# EAGLE design usbirtransceiver (EAGLE 6.2)
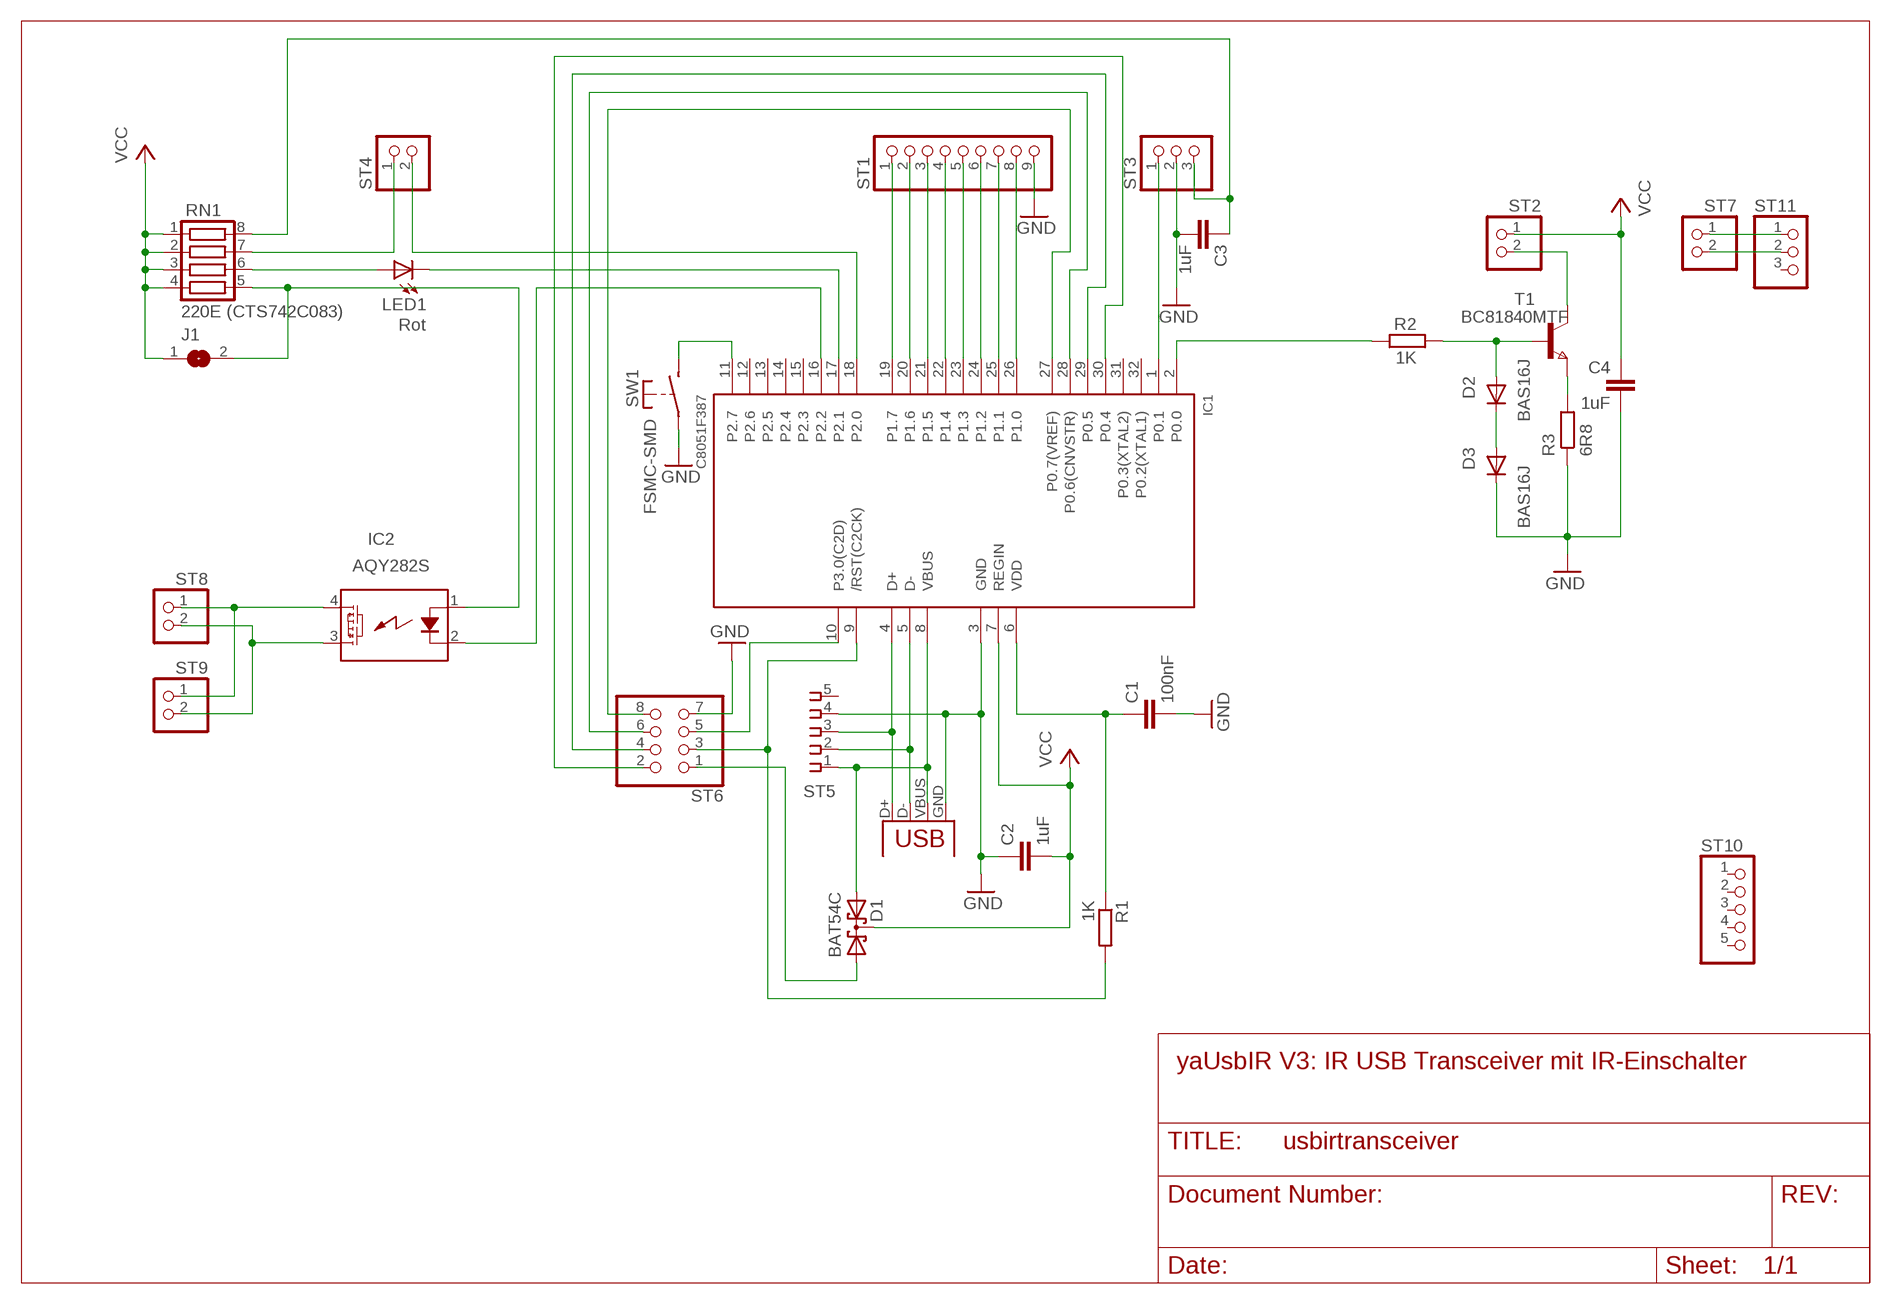
[diagram p0: schematic, sheet 1]

## Parts
C1  100nF  C-EUC0805  [C0805]
C2  1uF  C-EUC0805  [C0805]
C3  1uF  C-EUC0805  [C0805]
C4  1uF  C-EUC0805  [C0805]
D1  BAT54C  [SOT23]
D2  BAS16J  DIODE-SOD323-R  [SOD323-R]
D3  BAS16J  DIODE-SOD323-R  [SOD323-R]
IC1  C8051F387  C8051F342  [TQFP32-08]
IC2  AQY282S  AQY22SOP  [SOP04]
J1  SJ  [SJ]
LED1  Rot  LEDCHIP-LED0805  [CHIP-LED0805]
R1  1K  R-EU_R0805  [R0805]
R2  1K  R-EU_R0805  [R0805]
R3  6R8  R-EU_M1206  [M1206]
RN1  220E (CTS742C083)  CTS742C083  [CTS742C083]
ST1  PINHD-1X9  [1X09]
ST2  PINHD-1X2  [1X02]
ST3  PINHD-1X3  [1X03]
ST4  PINHD-1X2  [1X02]
ST5  CON5PINSMD2.54  [SMDTOP5]
ST6  PINHD-2X4  [2X04]
ST7  PINHD-1X2  [1X02]
ST8  PINHD-1X2  [1X02]
ST9  PINHD-1X2  [1X02]
ST10  PINHD-1X5_2.54-SMD-90°  [1X05SMD/90]
ST11  PINHD-1X3  [1X03]
ST12  USB-MB-S  [USB-MB-S]
SW1  FSMC-SMD  [FSMC-SMD]
T1  BC81840MTF  NPNSOT23  [SOT-23]

## Nets
GND [POWER]: C1.2 C2.1 C3.2 C4.2 D3.C IC1.3(GND) R3.1 ST1.9 ST3.2 ST5.4 ST6.7 ST12.GND SW1.P$1(P)
N$1: LED1.A RN1.6
N$2: RN1.7 ST4.1
N$3: IC2.1(A) J1.2 RN1.5
N$4: IC1.19(P1.7) ST1.1
N$5: IC1.20(P1.6) ST1.2
N$6: IC1.21(P1.5) ST1.3
N$7: IC1.22(P1.4) ST1.4
N$8: IC1.23(P1.3) ST1.5
N$9 [POWER]: ST2.2 T1.1(C)
N$10: IC1.24(P1.2) ST1.6
N$11: IC1.25(P1.1) ST1.7
N$12: IC1.26(P1.0) ST1.8
N$13: IC1.17(P2.1) LED1.C
N$14: IC2.4(DS1) ST8.1 ST9.1
N$15: C1.1 IC1.6(VDD) R1.1
N$16: ST7.1 ST11.1
N$17: IC1.27(P0.7(VREF)) ST6.8
N$18: D2.C D3.A
N$19: IC1.18(P2.0) ST4.2
N$20: IC1.16(P2.2) IC2.2(K)
N$22: D2.A R2.1 T1.3(B)
N$23: IC1.5(D-) ST5.2 ST12.D-
N$24: IC1.28(P0.6(CNVSTR)) ST6.6
N$25 [POWER]: R3.2 T1.2(E)
N$26: IC1.4(D+) ST5.3 ST12.D+
N$27: IC2.3(DS2) ST8.2 ST9.2
N$28: IC1.30(P0.4) ST6.2
N$30: IC1.10(P3.0(C2D)) ST6.5
N$31: IC1.1(P0.1) ST3.1
N$32: IC1.29(P0.5) ST6.4
N$33: IC1.9(/RST(C2CK)) R1.2 ST6.3
N$34: ST7.2 ST11.2
N$36: IC1.11(P2.7) SW1.P$2(S)
N$37: IC1.2(P0.0) R2.2
N$38 [POWER]: C3.1 RN1.8 ST3.3
VCC [POWER]: C2.2 C4.1 D1.3(CC) IC1.7(REGIN) J1.1 RN1.1 RN1.2 RN1.3 RN1.4 ST2.1
VCC1 [POWER3]: D1.2(A2) IC1.8(VBUS) ST5.1 ST12.VBUS
VCC2: D1.1(A1) ST6.1
Unconnected: IC1.12(P2.6) IC1.13(P2.5) IC1.14(P2.4) IC1.15(P2.3) IC1.31(P0.3(XTAL2)) IC1.32(P0.2(XTAL1)) ST5.5 ST10.1 ST10.2 ST10.3 ST10.4 ST10.5 ST11.3

## Notes on the sheet
- yaUsbIR V3: IR USB Transceiver mit IR-Einschalter

## Library data of the parts
C1 C2 C4 = resistor:C-EU: CAPACITOR, European symbol
C3 = resistor:C-EU: CAPACITOR, European symbol; SPAN: 25V; TOL: 10%
D1 = diode:BAT54C: Schottky Diodes Source: Fairchild .. BAT54.pdf
D2 D3 = diode:DIODE-: DIODE
IC1 = silabs-2:C8051F342: Full Speed USB Flash MCU
IC2 = relay:AQY*: PhotoMOS Relay NAiS Source: http://www.panasonic-electric-works.com/catalogues/downloads/photomos/ds_x615_en_aqz10_20.pdf; OC_FARNELL: unknown; OC_NEWARK: unknown
J1 = jumper:SJ: SMD solder JUMPER
LED1 = led:LED: LED OSRAM: - CHIPLED LG R971, LG N971, LY N971, LG Q971, LY Q971, LO R971, LY R971 LH N974, LH R974 LS Q976, LO Q976, LY Q976 LO Q996 - Hyper CHIPLED LW Q18S LB Q993, LB Q99A, LB R99A - SideLED LS A670, LO A670, LY A670, LG A670, LP A670 LB A673, LV A673, LT A673, LW A673 LH A674 LY A675 LS A676, LA A676, LO A676, LY A676, LW A676 LS A679, LY A679, LG A679 - Hyper Micro SIDELED® LS Y876, LA Y876, LO Y876, LY Y876 LT Y87S - SmartLED LW L88C, LW L88S LB L89C, LB L89S, LG L890 LS L89K, LO L89K, LY L89K LS L896, LA L896, LO L896, LY L896 - TOPLED LS T670, LO T670, LY T670, LG T670, LP T670 LSG T670, LSP T670, LSY T670, LOP T670, LYG T670 LG T671, LOG T671, LSG T671 LB T673, LV T673, LT T673, LW T673 LH T674 LS T676, LA T676, LO T676, LY T676, LB T676, LH T676, LSB T676, LW T676 LB T67C, LV T67C, LT T67C, LS T67K, LO T67K, LY T67K, LW E67C LS E67B, LA E67B, LO E67B, LY E67B, LB E67C, LV E67C, LT E67C LW T67C LS T679, LY T679, LG T679 LS T770, LO T770, LY T770, LG T770, LP T770 LB T773, LV T773, LT T773, LW T773 LH T774 LS E675, LA E675, LY E675, LS T675 LS T776, LA T776, LO T776, LY T776, LB T776 LHGB T686 LT T68C, LB T68C - Hyper Mini TOPLED® LB M676 - Mini TOPLED Santana® LG M470 LS M47K, LO M47K, LY M47K Source: http://www.osram.convergy.de LUXEON: - LUMILED® LXK2-PW12-R00, LXK2-PW12-S00, LXK2-PW14-U00, LXK2-PW14-V00 LXK2-PM12-R00, LXK2-PM12-S00, LXK2-PM14-U00 LXK2-PE12-Q00, LXK2-PE12-R00, LXK2-PE12-S00, LXK2-PE14-T00, LXK2-PE14-U00 LXK2-PB12-K00, LXK2-PB12-L00, LXK2-PB12-M00, LXK2-PB14-N00, LXK2-PB14-P00, LXK2-PB14-Q00 LXK2-PR12-L00, LXK2-PR12-M00, LXK2-PR14-Q00, LXK2-PR14-R00 LXK2-PD12-Q00, LXK2-PD12-R00, LXK2-PD12-S00 LXK2-PH12-R00, LXK2-PH12-S00 LXK2-PL12-P00, LXK2-PL12-Q00, LXK2-PL12-R00 Source: www.luxeon.com KINGBRIGHT: KA-3528ASYC Source: www.kingbright.com
R1-R3 = resistor:R-EU_: RESISTOR, European symbol
RN1 = resistor-net:CTS742C083: Chip Resistor Array 4 Single Resistor Source: http://www.ctscorp.com/components/Datasheets/CTSChipArrayDs.pdf; OC_FARNELL: unknown; OC_NEWARK: unknown
ST1 = pinhead:PINHD-1X9: PIN HEADER
ST2 ST4 ST7-ST9 = pinhead:PINHD-1X2: PIN HEADER
ST3 ST11 = pinhead:PINHD-1X3: PIN HEADER
ST5 = smdconnector2.54:CON5PINSMD2.54: connector
ST6 = pinhead:PINHD-2X4: PIN HEADER
ST10 = pinhead-1:PINHD-1X5: PIN HEADER
ST12 = con-usb:USB: USB Connectors
SW1 = switch-misc:FSMC-SMD: TYCO SWITCH
T1 = zetex:NPNSOT23: NPN TRANSISTOR; MPN: DSS20201L-7; OC_FARNELL: 1710688; OC_NEWARK: 25R4555

## Net classes
1 POWER: width 0.559 mm
2 POWER2: width 1.321 mm
3 POWER3: width 0.559 mm

## Board
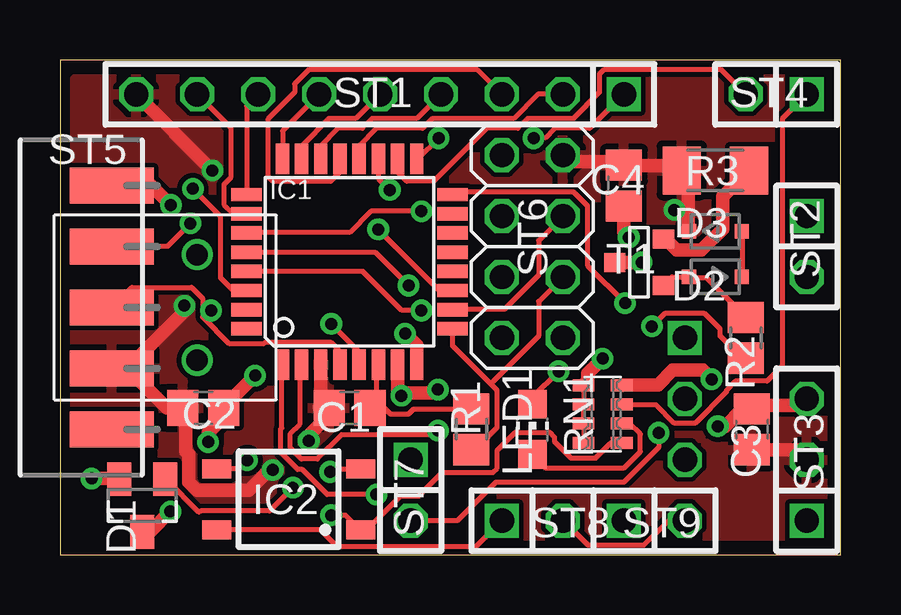
[diagram p1: board, top side]
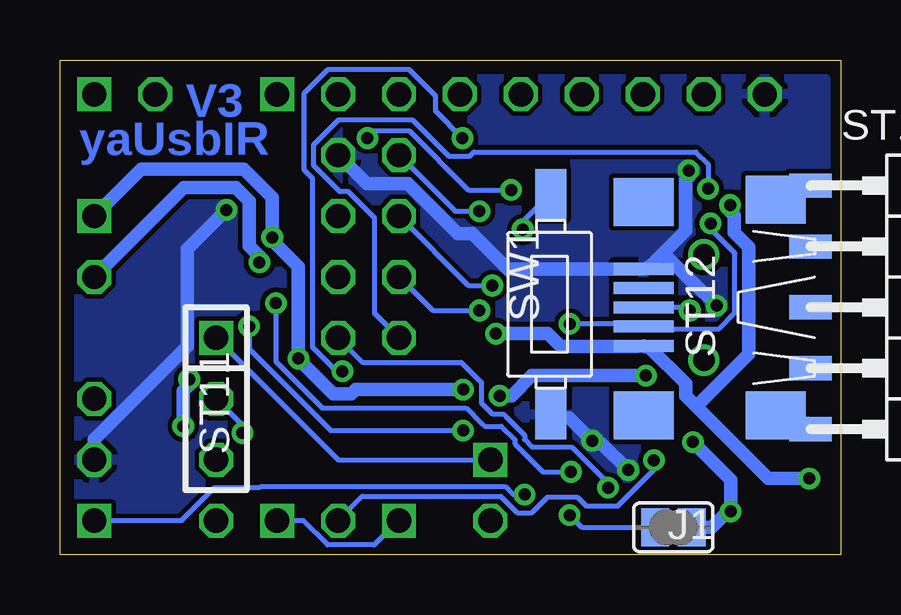
[diagram p2: board, bottom side, seen from below]

Size 32.54 x 20.64 mm. Coordinates in mm from the lower left corner, seen from the top.
Outline: 0,0 32.54,0 32.54,20.64 0,20.64 0,0
Copper layers (1*16): Top 0.035mm / dielectric 1.5mm / Bottom 0.035mm
Design rules: minimum track width 0.2mm, minimum drill 0.5mm, track to track 0.2mm, track to pad 0.2mm, pad to pad 0.15mm, via to via 0.2mm, smd to smd 0mil, copper to edge 0.2mm, drill to drill 0.2mm, minimum pad ring 0.2mm, minimum via ring 0.2mm, stop-mask expansion 0.1mm, vias tented up to drill 0mil, thermal gap 10mil

### Footprints (pad centres in the part's own frame; a part is rotated, then mirrored left to right if it is on the bottom)
C0805 = smd 1.3 x 1.5: 1 -0.85,0; 2 0.85,0
SOT23 = smd 1 x 1.4: 1 -0.95,-1.1; 2 0.95,-1.1; 3 0,1.1
SOD323-R = smd 0.6 x 0.6: A 1.1,0; C -1.1,0
TQFP32-08 = smd 1.27 x 0.559: 1 -4.293,2.8; 2 -4.293,2; 3 -4.293,1.2; 4 -4.293,0.4; 5 -4.293,-0.4; 6 -4.293,-1.2; 7 -4.293,-2; 8 -4.293,-2.8; 17 4.293,-2.8; 18 4.293,-2; 19 4.293,-1.2; 20 4.293,-0.4; 21 4.293,0.4; 22 4.293,1.2; 23 4.293,2; 24 4.293,2.8 | smd 0.559 x 1.27: 9 -2.8,-4.293; 10 -2,-4.293; 11 -1.2,-4.293; 12 -0.4,-4.293; 13 0.4,-4.293; 14 1.2,-4.293; 15 2,-4.293; 16 2.8,-4.293; 25 2.8,4.293; 26 2,4.293; 27 1.2,4.293; 28 0.4,4.293; 29 -0.4,4.293; 30 -1.2,4.293; 31 -2,4.293; 32 -2.8,4.293
SOP04 = smd 0.8 x 1.2: 1 -1.27,-3; 2 1.27,-3; 3 1.27,3; 4 -1.27,3
SJ = smd 1.168 x 1.6: 1 -0.762,0; 2 0.762,0
CHIP-LED0805 = smd 1.2 x 1.2: A 0,-1.05; C 0,1.05
R0805 = smd 1.3 x 1.5: 1 -0.85,0; 2 0.85,0
M1206 = smd 1.6 x 2: 1 -1.4,0; 2 1.4,0
CTS742C083 = smd 0.5 x 0.9: 1 -1.2,-0.8; 2 -0.4,-0.8; 3 0.4,-0.8; 4 1.2,-0.8; 5 1.2,0.8; 6 0.4,0.8; 7 -0.4,0.8; 8 -1.2,0.8
1X09 = drill 1.016 square: 1 -10.16,0 | drill 1.016 octagon: 2 -7.62,0; 3 -5.08,0; 4 -2.54,0; 5 0,0; 6 2.54,0; 7 5.08,0; 8 7.62,0; 9 10.16,0
1X02 = drill 1.016 square: 1 -1.27,0 | drill 1.016 octagon: 2 1.27,0
1X03 = drill 1.016 square: 1 -2.54,0 | drill 1.016 octagon: 2 0,0; 3 2.54,0
SMDTOP5 = smd 3.5 x 1.5: 1 -1.27,5.715; 2 -1.27,3.175; 3 -1.27,0.635; 4 -1.27,-1.905; 5 -1.27,-4.445
2X04 = drill 1.016 octagon: 1 -3.81,-1.27; 2 -3.81,1.27; 3 -1.27,-1.27; 4 -1.27,1.27; 5 1.27,-1.27; 6 1.27,1.27; 7 3.81,-1.27; 8 3.81,1.27
1X05SMD/90 = smd 1.016 x 1.778: 1 -1.27,-5.08; 2 1.27,-5.08; 3 3.81,-5.08; 4 6.35,-5.08; 5 8.89,-5.08
USB-MB-S = smd 2.5 x 0.5: D+ 2.5,0; D- 2.5,0.8; GND 2.5,-1.6; ID 2.5,-0.8; VBUS 2.5,1.6 | smd 2.5 x 2: P$1 -3,-4.5; P$2 -3,4.5; P$3 2.5,-4.4; P$4 2.5,4.5 | drill 0.9: P$5 0,2.2; P$6 0,-2.2
FSMC-SMD = smd 1.3 x 2.1: P$1 -0.096,4.584; P$2 -0.096,-4.6
SOT-23 = smd 0.787 x 0.889: 1 0.025,-1.016; 2 -0.94,1.016; 3 0.991,1.016

### Placement (x,y rotation side)
C1  12.07,6.13 180 top
C2  5.97,6.13 0 top
C3  28.83,5.24 270 top
C4  23.5,15.4 90 top
D1  3.43,2.06 180 top
D2  27.3,11.59 180 top
D3  27.3,13.49 0 top
IC1  12.07,12.22 90 top
IC2  9.52,2.32 90 top
J1  6.99,1.15 180 bottom
LED1  19.68,5.24 0 top
R1  17.14,5.24 270 top
R2  28.57,9.05 270 top
R3  27.3,16.04 0 top
RN1  22.61,5.88 270 top
ST1  13.34,19.21 180 top
ST2  31.11,12.86 270 top
ST3  31.11,3.97 90 top
ST4  29.85,19.21 180 top
ST5  3.42,9.69 0 top
ST6  19.68,12.86 90 top
ST7  14.61,2.7 270 top
ST8  19.68,1.43 0 top
ST9  24.77,1.43 0 top
ST10  -3.81,14.13 270 bottom
ST11  26.04,6.51 270 bottom
ST12  5.72,10.32 180 bottom
SW1  12.19,10.45 180 bottom
T1  24.13,12.22 270 top

### Tracks (layer width: path | path; a pad name or v marks a point on that pad's centre or on a via)
GND  (via drill 0.5)
  Top 0.559: ST3.2 30.71,4.38 28.83,4.38 C3.2 | 26.19,14.38 26.19,15.76 R3.1 25.73,16.24 23.5,16.24 C4.2 23.24,16.39 21.23,16.39 ST6.7 | 26.19,14.38 26.19,13.49 D3.C | v6.35,16.04 ST1.9 | 26.19,14.38 v25.6,14.38 | v5.18,10.4 5.18,10.14 3,7.96 ST5.4 2.79,7.78 4.45,6.13 C2.1 5.23,5.88 5.23,4.33 5.36,4.2 5.36,3.06 5.72,2.7 7.87,2.7 8.71,3.54 v8.86,3.54 | IC1.3 10.87,6.46 11.2,6.13 C1.2 | 10.8,6.15 C1.2 | v10.36,4.76 10.36,4.99 11.23,5.85 C1.2
  Bottom 0.559: ST6.7 19.76,15.48 18.06,15.48 15.98,13.39 15.37,13.39 13.89,11.92 8.23,11.92 ST12.GND 7.95,12.05 7.4,12.59 | v6.35,16.04 6.35,15.78 6.48,15.65 6.48,13.52 7.4,12.59 | ST3.2 31.11,4.81 27.23,8.69 27.23,12.76 v25.6,14.38 | v5.18,10.4 6.17,11.39 6.2,11.39 7.4,12.59 | 11.94,5.85 SW1.P$1 11.68,5.72 11.33,5.72 v10.36,4.76 10.11,4.63 9.96,4.63 v8.86,3.54
  pour Bottom: 0.64,19.85 31.75,19.85 31.75,0.8 0.64,0.8
  pour Top: 0.64,19.85 31.75,19.85 31.75,0.8 0.64,0.8
N$1
  Top 0.2: RN1.6 23.42,5.47 23.75,5.47 24.18,5.04 24.18,4.3 23.52,3.64 20.22,3.64 19.68,4.17 LED1.A
N$2
  Top 0.2: ST4.1 30.1,18.19 30.1,7.88 29.46,7.25 28.14,7.25 27.76,6.87 27.76,6.79 26.47,5.49 25.6,5.49 24.84,6.26 23.42,6.26 RN1.7
N$3  (via drill 0.5)
  Top 0.2: RN1.5 23.39,4.66 22.94,4.66 22.33,4.05 21.29,4.05 20.6,4.73 20.6,4.91 20.4,5.11 18.97,5.11 18.21,4.35 18.21,3.61 18.03,3.44 15.93,3.44 14.93,2.45 14.17,2.45 12.78,1.05 IC2.1 12.45,1.1 11.89,1.66 v11.3,1.66
  Bottom 0.2: v11.3,1.66 10.8,1.15 J1.2
N$4  (via drill 0.5)
  Top 0.2: v13.74,15.22 13.28,15.68 13.28,16.52 IC1.19 | v19.74,17.38 20.22,17.38 20.62,17.79 22.07,17.79 ST1.1
  Bottom 0.2: v13.74,15.22 15.52,15.22 17.98,17.69 19.43,17.69 v19.74,17.38
N$5
  Top 0.2: ST1.2 19.91,19.21 18.9,18.19 15.52,18.19 15.11,17.79 13.18,17.79 12.47,17.08 IC1.20
N$6
  Top 0.2: ST1.3 17.4,20.23 10.36,20.23 9.78,19.64 9.78,19.29 8.66,18.17 8.66,15.78 8.86,15.58 11.28,15.58 11.66,15.96 IC1.21
N$7
  Top 0.2: ST1.4 14.86,18.19 13,18.19 12.6,17.79 11.58,17.79 10.87,17.08 IC1.22
N$8
  Top 0.2: ST1.5 12.32,18.19 11.2,18.19 10.08,17.08 10.08,16.52 IC1.23
N$9  (via drill 0.5)
  Top 0.559: v24.23,12.2 T1.1
  Bottom 0.559: v24.23,12.2 24.23,12.45 24.66,12.88 24.66,14.76 25.22,15.32 27.38,15.32 ST2.2
N$10
  Top 0.2: ST1.6 9.27,17.69 IC1.24
N$11
  Top 0.2: IC1.25 7.77,18.73 ST1.7
N$12
  Top 0.2: ST1.8 7.11,17.81 7.11,15.73 6.83,15.45 6.83,14.61 7.21,14.23 IC1.26
N$13  (via drill 0.5)
  Top 0.2: LED1.C 19.68,6.56 v20.78,7.65 | v15.77,17.38 14.91,16.52 IC1.17
  Bottom 0.2: v20.78,7.65 21.01,7.65 22.02,8.67 22.02,15.71 22.38,16.06 22.38,19.24 21.39,20.23 17.98,20.23 16.89,19.13 16.89,18.5 v15.77,17.38
N$14
  Top 0.2: IC2.4 10.85,1.05 11.56,0.34 17.32,0.34 ST8.1
  Bottom 0.2: ST9.1 22.4,1.43 21.39,0.41 19.46,0.41 18.49,1.38 ST8.1
N$15
  Top 0.2: IC1.6 13.21,7.86 13.21,6.41 12.93,6.13 C1.1 13.28,6.36 13.77,5.88 14.53,5.88 14.73,6.08 17.14,6.08 R1.1
N$16
  Bottom 0.2: ST11.1 20.95,3.97 ST7.1
N$17  (via drill 0.5)
  Top 0.2: v15.06,14.33 12.95,14.33 12.07,13.44 7.77,13.44 IC1.27
  Bottom 0.2: v15.06,14.33 16.08,14.33 ST6.8
N$18
  Top 0.2: D2.C 28.42,11.59 28.42,13.49 D3.A
N$19
  Top 0.2: ST4.2 27.56,20.23 22.66,20.23 22.48,20.05 22.48,19.29 21.39,18.19 19.48,18.19 19.07,17.79 17.78,17.79 15.57,15.58 14.45,15.58 14.07,15.96 IC1.18
N$20  (via drill 0.5)
  Top 0.2: v23.55,10.5 21.97,12.07 21.97,14.56 21.39,15.15 16.46,15.15 16.36,15.04 IC1.16 | IC2.2 11.38,3.59 v11.25,3.46
  Bottom 0.2: v23.55,10.5 23.55,8.06 21.61,6.13 15.62,6.13 14.96,5.47 14.88,5.42 14.83,5.37 14.15,5.37 13.59,4.81 13.59,4.63 12.42,3.46 v11.25,3.46
N$22
  Top 0.2: T1.3 25.5,11.59 D2.A 26.29,11.54 26.95,11.54 28.57,9.91 R2.1
N$23  (via drill 0.5)
  Top 0.2: v11.3,9.63 12.45,8.49 12.45,7.93 IC1.5 | ST5.2 4.47,12.86 v5.44,13.83
  Bottom 0.2: v11.3,9.63 8.33,9.63 8.23,9.53 ST12.D- 8.18,9.43 5.08,9.43 4.42,10.09 4.42,12.58 5.44,13.6 v5.44,13.83
N$24  (via drill 0.5)
  Top 0.2: v14.53,11.23 13.16,12.61 7.77,12.61 IC1.28
  Bottom 0.2: v14.53,11.23 15.52,11.23 ST6.6
N$25
  Top 0.559: T1.2 25.25,13.17 25.7,12.71 26.72,12.71 27.61,13.6 27.61,14.94 R3.2
N$26  (via drill 0.5)
  Top 0.2: 5.94,10.19 5.94,10.7 5.49,11.16 3,11.16 ST5.3 | 5.94,10.19 5.94,9.91 7.04,8.82 8.51,8.82 8.56,8.87 11.28,8.87 11.66,8.49 IC1.4 | 5.94,10.19 v6.3,10.19
  Bottom 0.2: ST12.D+ 6.43,10.32 v6.3,10.19
N$27  (via drill 0.5)
  Top 0.2: ST9.2 25.35,1.43 24.33,0.41 22,0.41 21.03,1.38 ST8.2 | IC2.3 7.44,3.59 v7.8,3.94
  Bottom 0.2: v7.8,3.94 7.8,3.54 9.3,2.04 10.62,2.04 11,2.42 12.22,2.42 12.88,1.76 13.49,1.76 14.17,2.45 19.94,2.45 ST8.2
N$28  (via drill 0.5)
  Top 0.2: v5.54,15.27 6.68,14.13 6.68,11.56 7.21,11.03 IC1.30
  Bottom 0.2: v5.54,15.27 5.54,16.29 6.05,16.8 15.29,16.8 15.47,16.62 16.33,16.62 17.86,18.14 20.93,18.14 21.97,17.1 21.97,16.24 20.88,15.15 20.52,15.15 19.43,14.05 19.43,10.07 ST6.2
N$30
  Top 0.2: ST6.5 19.94,13.11 19.94,11.67 18.52,10.24 16.36,10.24 IC1.10
N$31  (via drill 0.5)
  Top 0.2: v13.18,2.52 11.12,2.52 10.08,3.56 9.91,3.56 9.2,4.28 9.2,5.24 9.25,5.29 9.25,7.93 IC1.1
  Bottom 0.2: v13.18,2.52 13.66,2.52 14,2.85 24.15,2.85 24.23,2.8 26.11,2.8 27.48,1.43 ST3.1
N$32  (via drill 0.5)
  Top 0.2: v15.06,10.19 14.25,10.19 12.62,11.82 IC1.29
  Bottom 0.2: v15.06,10.19 17.02,10.19 ST6.4
N$33
  Top 0.2: IC1.9 16.36,8.72 17.95,7.13 | 17.95,7.13 18.21,6.87 18.21,5.32 17.3,4.4 17.14,4.4 R1.2 | 17.95,7.13 19.94,9.13 19.94,10.57 ST6.3
N$34  (via drill 0.5)
  Top 0.2: v24.94,5.09 24.94,4.48 23.5,3.03 18.16,3.03 16.56,1.43 ST7.2
  Bottom 0.2: v24.94,5.09 24.94,5.42 ST11.2
N$36  (via drill 0.5)
  Top 0.2: v13.26,13.57 15.8,11.03 IC1.11
  Bottom 0.2: v13.26,13.57 13.26,13.9 12.12,15.04 SW1.P$2
N$37  (via drill 0.5)
  Top 0.2: 15.62,5.06 v15.75,5.19 15.54,5.01 11.73,5.01 10.72,3.99 10.06,3.99 9.6,4.45 9.6,5.06 10.01,5.47 10.01,7.86 IC1.2 | v24.66,9.53 25.2,10.07 26.87,10.07 27.51,9.43 27.51,9.13 28.42,8.21 28.57,8.21 R2.2
  Bottom 0.2: v15.75,5.19 21.26,5.19 24.66,8.59 v24.66,9.53
N$38  (via drill 0.5)
  Top 0.559: v27.15,7.32 26.77,7.7 25.53,7.7 24.92,7.09 23.42,7.09 RN1.8 | v27.41,5.37 27.71,5.37 28.42,6.08 28.83,6.08 C3.1 29.08,6.23 30.84,6.23 ST3.3
  Bottom 0.559: v27.15,7.32 27.15,7.09 27.41,6.84 v27.41,5.37
VCC  (via drill 0.5)
  Top 0.2: RN1.1 21.82,6.81 21.82,6.28 RN1.2 21.82,6.18 21.82,5.57 RN1.3 21.82,5.47 21.82,4.68 RN1.4
  Top 0.559: v4.6,1.81 3.76,0.97 D1.3 | v6.17,4.71 6.17,5.09 6.96,5.88 C2.2 7.01,6.36 v8.13,7.47 | IC1.7 14.07,6.79 v14.22,6.64 14.48,6.76 15.62,6.76 v15.75,6.89 | C4.1 23.5,13.44 v23.7,13.24 | v22.61,8.19 22,7.58 22,7.3 RN1.1
  Bottom 0.559: v6.17,4.71 4.6,3.13 v4.6,1.81 4.85,1.68 5.39,1.15 J1.1 | v14.22,6.64 13.72,6.64 12.88,7.47 v8.13,7.47 | v15.75,6.89 20.22,6.89 20.4,6.71 21.16,6.71 22.43,7.98 v22.61,8.19 22.61,12.02 23.57,12.99 v23.7,13.24 23.7,14.89 24.89,16.09 29.16,16.09 ST2.1
VCC1  (via drill 0.5)
  Top 0.559: v1.32,3.18 2.46,3.18 D1.2 | ST5.1 3.81,15.4 v4.62,14.59 | v14.38,9.23 14.86,8.74 IC1.8
  Bottom 0.559: v1.32,3.18 3.02,3.18 6.03,6.19 | 6.03,6.19 6.48,6.64 6.48,7.14 8,8.67 8.13,8.67 ST12.VBUS 8.48,8.69 11.68,8.69 12.22,9.23 v14.38,9.23 | v4.62,14.59 4.62,14.33 4.45,14.15 4.45,13.44 3.83,12.83 3.83,8.39 6.03,6.19
VCC2  (via drill 0.5)
  Top 0.2: 4.39,3.16 D1.1 4.47,3.11 5.79,1.79 5.87,1.84 8.74,1.84 v9.7,2.8
  Bottom 0.2: ST6.1 19.94,8.03 15.82,8.03 14.99,7.2 14.99,6.33 14.53,5.88 14.07,5.88 14,5.82 13.95,5.75 13.18,4.99 13.18,4.81 12.88,4.5 11.23,4.5 9.7,2.98 v9.7,2.8

### Text on the board
Bottom: V3 | yaUsbIR